# EAGLE design servo_v3_my_v4 (EAGLE 7.6.0)
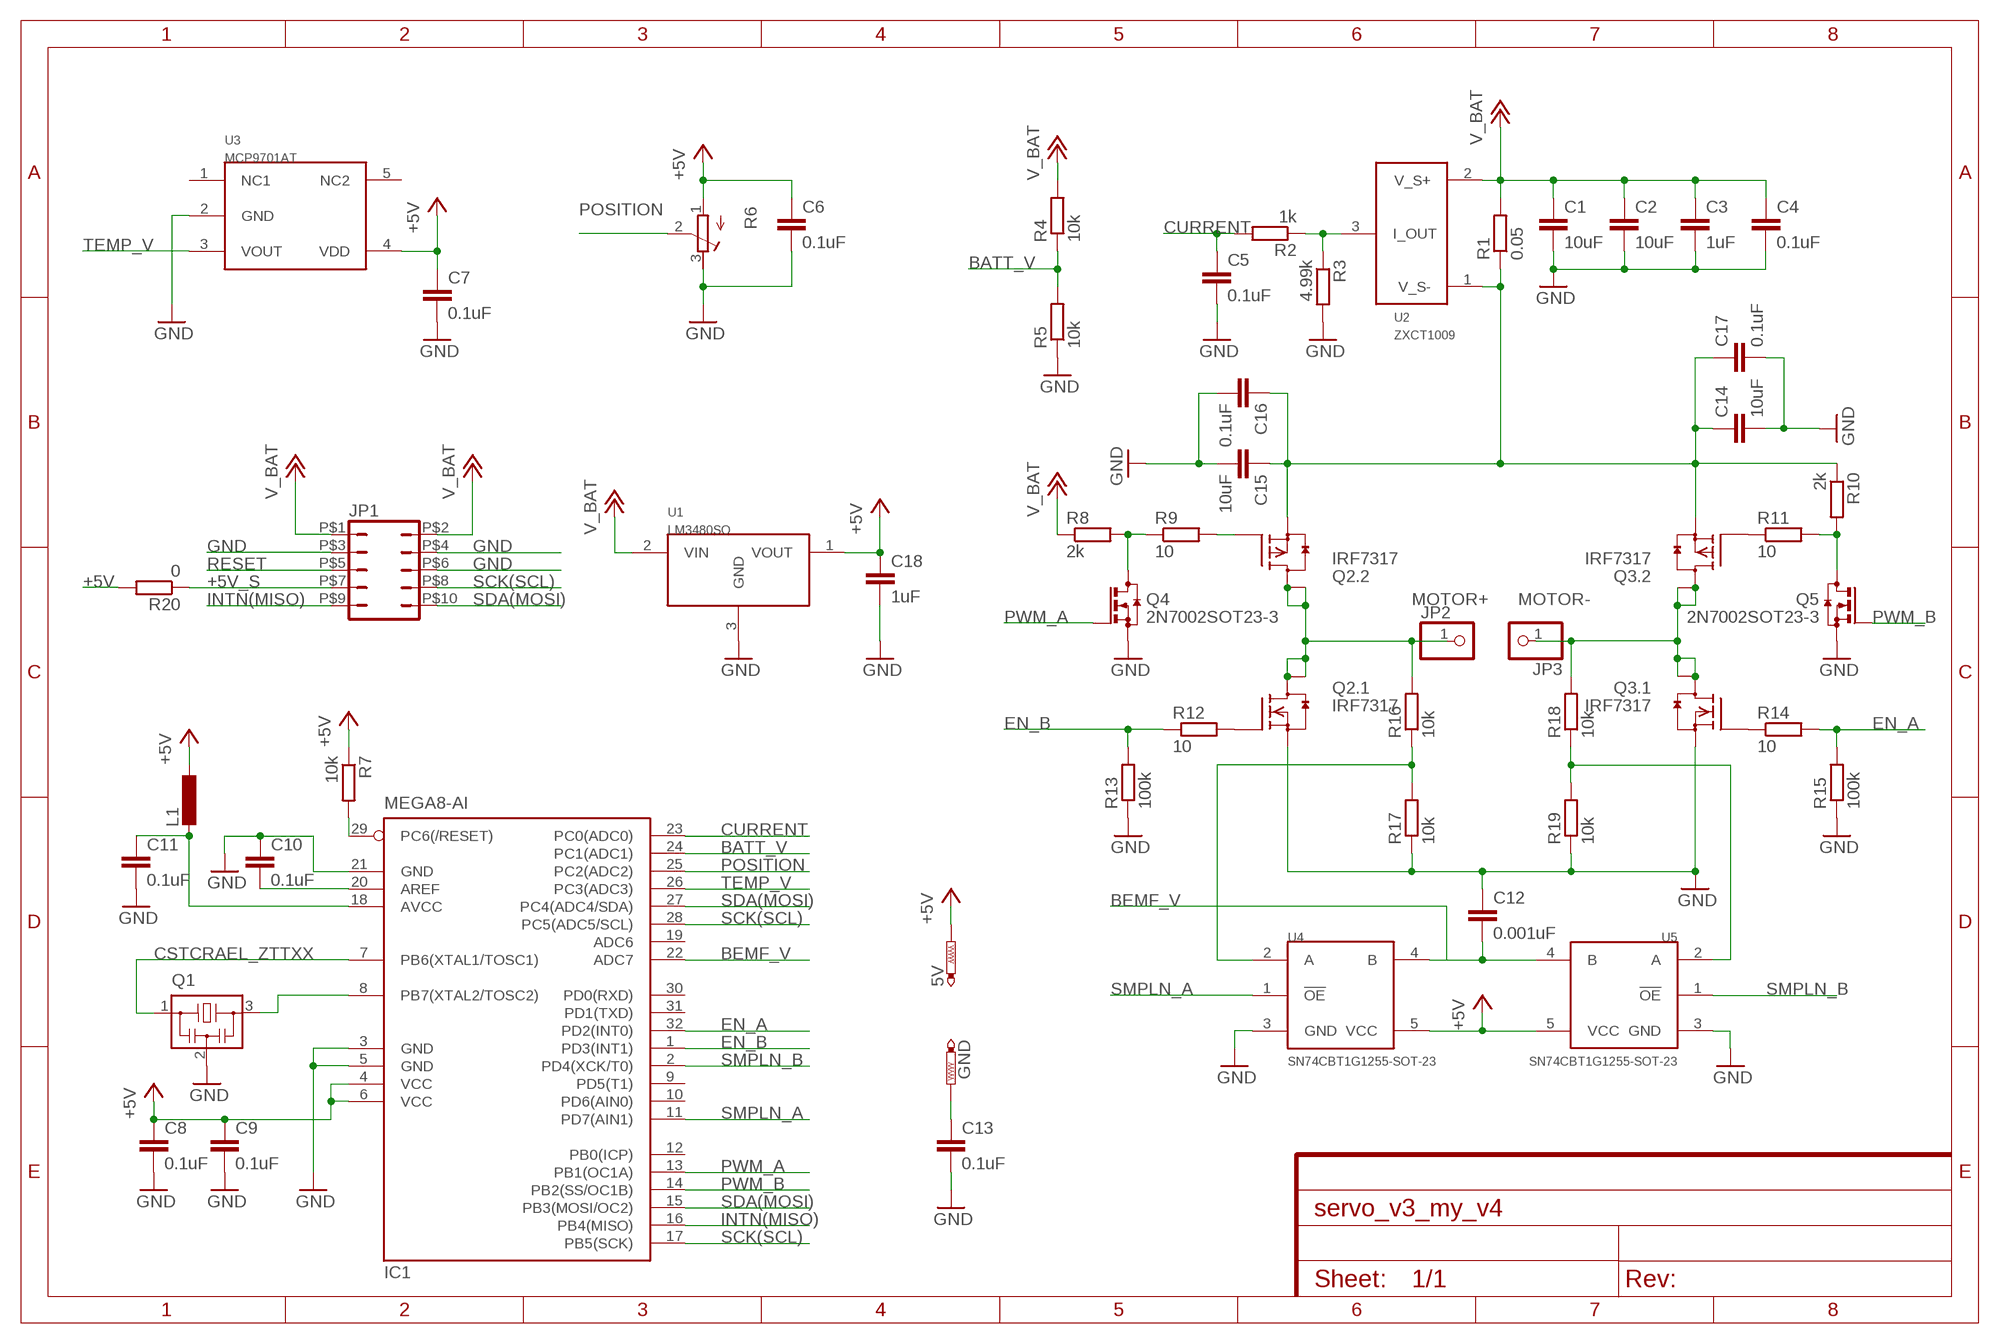
[diagram p0: schematic, sheet 1]

## Parts
5V  PTR1B1,27  [B1,27]
C1  10uF  C-EUC1206  [C1206]
C2  10uF  C-EUC1206  [C1206]
C3  1uF  C-EUC0603  [C0603]
C4  0.1uF  C-EUC0603  [C0603]
C5  0.1uF  C-EUC0603  [C0603]
C6  0.1uF  C-EUC0603  [C0603]
C7  0.1uF  C-EUC0603  [C0603]
C8  0.1uF  C-EUC0603  [C0603]
C9  0.1uF  C-EUC0603  [C0603]
C10  0.1uF  C-EUC0603  [C0603]
C11  0.1uF  C-EUC0603  [C0603]
C12  0.001uF  C-EUC0603  [C0603]
C13  0.1uF  C-EUC0603  [C0603]
C14  10uF  C-EUC1206  [C1206]
C15  10uF  C-EUC1206  [C1206]
C16  0.1uF  C-EUC0603  [C0603]
C17  0.1uF  C-EUC0603  [C0603]
C18  1uF  C-EUC0603  [C0603]
GND  PTR1B1,27  [B1,27]
IC1  MEGA8-AI  [TQFP32-08]
JP1  JP5QJP5Q_SMD  [JP5_DUAL_SIDE]
JP2  PINHD-1X1  [1X01]
JP3  PINHD-1X1  [1X01]
L1  L-EUL0603  [C0603]
Q1  CSTCRAEL_ZTTXX  [CSTCE_WIDE]
Q2  IRF7317  [SO-8]
Q3  IRF7317  [SO-8]
Q4  2N7002SOT23-3  [SOT23]
Q5  2N7002SOT23-3  [SOT23]
R1  0.05  R-EU_R1206  [R1206]
R2  1k  R-EU_R0603  [R0603]
R3  4.99k  R-EU_R0603  [R0603]
R4  10k  R-EU_R0603  [R0603]
R5  10k  R-EU_R0603  [R0603]
R6  R-TRIMM  [RTRIM_SMALL]
R7  10k  R-EU_R0603  [R0603]
R8  2k  R-EU_R0603  [R0603]
R9  10  R-EU_R0603  [R0603]
R10  2k  R-EU_R0603  [R0603]
R11  10  R-EU_R0603  [R0603]
R12  10  R-EU_R0603  [R0603]
R13  100k  R-EU_R0603  [R0603]
R14  10  R-EU_R0603  [R0603]
R15  100k  R-EU_R0603  [R0603]
R16  10k  R-EU_R0603  [R0603]
R17  10k  R-EU_R0603  [R0603]
R18  10k  R-EU_R0603  [R0603]
R19  10k  R-EU_R0603  [R0603]
R20  0  R-EU_R0603  [R0603]
U1  LM3480SO  [SOT23]
U2  ZXCT1009  [SOT23]
U3  MCP9701AT  [SC-70-5]
U4  SN74CBT1G1255-SOT-23  [SOT23-5]
U5  SN74CBT1G1255-SOT-23  [SOT23-5]

## Nets
+5V: 5V.TP C6.1 C7.1 C8.1 C9.1 C18.1 IC1.4(VCC) IC1.6(VCC) L1.1 R6.1(A) R7.1 R20.2 U1.1(VOUT) U3.4(VDD) U4.5(VCC) U5.5(VCC)
+5V_S: JP1.P$7 R20.1
BATT_V: IC1.24(PC1(ADC1)) R4.1 R5.2
BEMF_V: C12.2 IC1.22(ADC7) U4.4(B) U5.4(B)
CURRENT: C5.1 IC1.23(PC0(ADC0)) R2.2
EN_A: IC1.32(PD2(INT0)) R14.2 R15.2
EN_B: IC1.1(PD3(INT1)) R12.1 R13.2
GND: C1.2 C2.2 C3.2 C4.2 C5.2 C6.2 C7.2 C8.2 C9.2 C10.1 C11.2 C12.1 C13.2 C14.2 C15.2 C16.2 C17.2 C18.2 IC1.3(GND) IC1.5(GND) IC1.21(GND) JP1.P$3 JP1.P$4 JP1.P$6 Q1.2 Q2.1(.1:S) Q3.1(.1:S) Q4.2(S) Q5.2(S) R3.2 R5.1 R6.3(E) R13.1 R15.1 R17.1 R19.1 U1.3(GND) U3.2(GND) U4.3(GND) U5.3(GND)
INTN(MISO): IC1.16(PB4(MISO)) JP1.P$9
MOTOR+: JP2.1 Q2.5(.2:D) Q2.6(.2:D) Q2.7(.1:D) Q2.8(.1:D) R16.2
MOTOR-: JP3.1 Q3.5(.2:D) Q3.6(.2:D) Q3.7(.1:D) Q3.8(.1:D) R18.2
N$1: R2.1 R3.1 U2.3(I_OUT)
N$2: IC1.7(PB6(XTAL1/TOSC1)) Q1.1
N$3: IC1.8(PB7(XTAL2/TOSC2)) Q1.3
N$4: C11.1 IC1.18(AVCC) L1.2
N$5: C10.2 IC1.20(AREF)
N$6: C14.1 C15.1 C16.1 C17.1 Q2.3(.2:S) Q3.3(.2:S) R1.1 R10.1 U2.1(V_S-)
N$7: Q4.3(D) R8.2 R9.1
N$8: Q2.4(.2:G) R9.2
N$9: Q5.3(D) R10.2 R11.2
N$10: C13.1 GND.TP
N$14: Q2.2(.1:G) R12.2
N$15: Q3.2(.1:G) R14.1
N$18: Q3.4(.2:G) R11.1
N$20: R18.1 R19.2 U5.2(A)
N$21: R16.1 R17.2 U4.2(A)
POSITION: IC1.25(PC2(ADC2)) R6.2(S)
PWM_A: IC1.13(PB1(OC1A)) Q4.1(G)
PWM_B: IC1.14(PB2(SS/OC1B)) Q5.1(G)
RESET: IC1.29(PC6(/RESET)) JP1.P$5 R7.2
SCK(SCL): IC1.17(PB5(SCK)) IC1.28(PC5(ADC5/SCL)) JP1.P$8
SDA(MOSI): IC1.15(PB3(MOSI/OC2)) IC1.27(PC4(ADC4/SDA)) JP1.P$10
SMPLN_A: IC1.11(PD7(AIN1)) U4.1(!OE)
SMPLN_B: IC1.2(PD4(XCK/T0)) U5.1(!OE)
TEMP_V: IC1.26(PC3(ADC3)) U3.3(VOUT)
V_BAT: C1.1 C2.1 C3.1 C4.1 JP1.P$1 JP1.P$2 R1.2 R4.2 R8.1 U1.2(VIN) U2.2(V_S+)
Unconnected: IC1.9(PD5(T1)) IC1.10(PD6(AIN0)) IC1.12(PB0(ICP)) IC1.19(ADC6) IC1.30(PD0(RXD)) IC1.31(PD1(TXD)) U3.1(NC1) U3.5(NC2)

## Library data of the parts
5V GND = testpad:PTR1: TEST PIN; OC_NEWARK: unknown
C1-C11 C13-C18 = rcl:C-EU: CAPACITOR, European symbol; OC_NEWARK: unknown
C12 = rcl:C-EU: CAPACITOR, European symbol; MPN: BFC237052102; OC_NEWARK: 74K3422
IC1 = atmel:MEGA8: MICROCONTROLLER 8 Kbytes FLASH, 1 kbytes SRAM, 512 bytes EEPROM, USART, 6-channel 10 bit ADC, 2-channel 8 bit ADC Pin compatible with Atmega48, ATMega88, ATMega168 Source: avr.lbr; MPN: ATMEGA8-16AU; OC_FARNELL: 9171371; OC_NEWARK: unknown
JP1 = jumper:JP5Q: JUMPER; OC_NEWARK: unknown
JP2 JP3 = pinhead:PINHD-1X1: PIN HEADER; OC_NEWARK: unknown
L1 = rcl:L-EU: INDUCTOR, European symbol; OC_NEWARK: unknown
Q1 = murata-filter:CSTCR: Resonator Source: murata.co.jp; OC_NEWARK: unknown
Q2 Q3 = m-pad-2.1:IRF7317: International Rectifier's IRF7317 HEXFET® Power MOSFET Description: Fifth Generation HEXFETs from International Rectifier utilize advanced processing techniques to achieve extremely low on-resistance per silicon area. This benefit, combined with the fast switching speed and ruggedized device design that HEXFET Power MOSFETs are well known for, provides the designer with an extremely efficient and reliable device for use in a wide variety of applications. The SO-8 has been modified through a customized leadframe for enhanced thermal characteristics and multiple-die capability making it ideal in a variety of power applications. With these improvements, multiple devices can be used in an application with dramatically reduced board space. The package is designed for vapor phase, infra red, or wave soldering techniques. Features: Generation V Technology Ultra Low On-Resistance Dual N and P Channel MOSFET Surface Mount Fully Avalanche Rated Please send any comments to: messi@users.sourceforge.net; OC_NEWARK: unknown
Q4 Q5 = transistor-small-signal:2N7002: N-channel enhancement mode Field-Effect Transistor (FET) in a plastic package using TrenchMOS technology. SOT23; OC_NEWARK: unknown
R1-R5 R7-R20 = rcl:R-EU_: RESISTOR, European symbol; OC_NEWARK: unknown
R6 = rcl:R-TRIMM: Trimm resistor; OC_NEWARK: unknown
U1 = texas:LM3480: LM3480 100-mA, SOT-23, Quasi Low-Dropout Linear Voltage Regulator; Input Voltage Range: up to 30 V, 3.3-V, 5-V, 12-V, and 15-V Versions Available; link: http://www.farnell.com/datasheets/1997652.pdf; OC_NEWARK: unknown
U2 = diode:ZXCT1009: The ZXCT1009 is a high side current sense monitor. Using this device eliminates the need to disrupt the ground plane when sensing a load current.; OC_NEWARK: unknown
U3 = microchip:MCP9701AT: Tiny Analog Temperature Sensor; OC_NEWARK: unknown
U4 U5 = m-pad-2.1:SN74CBT1G125: 5-Ω Switch Connection Between Two Ports TTL-Compatible Control Input Levels Latch-Up Performance Exceeds 250 mA Per JESD 17 ESD Protection Exceeds JESD 22 – 2000-V Human-Body Model (A114-A) – 200-V Machine Model (A115-A) http://www.farnell.com/datasheets/1862443.pdf; OC_NEWARK: unknown

## Board
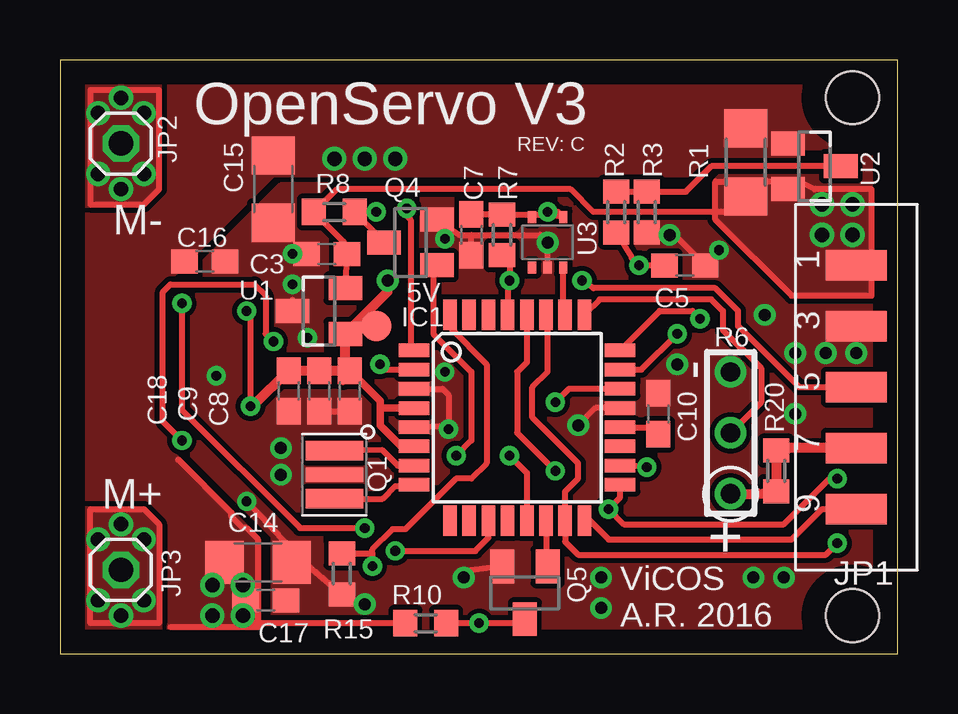
[diagram p1: board, top side]
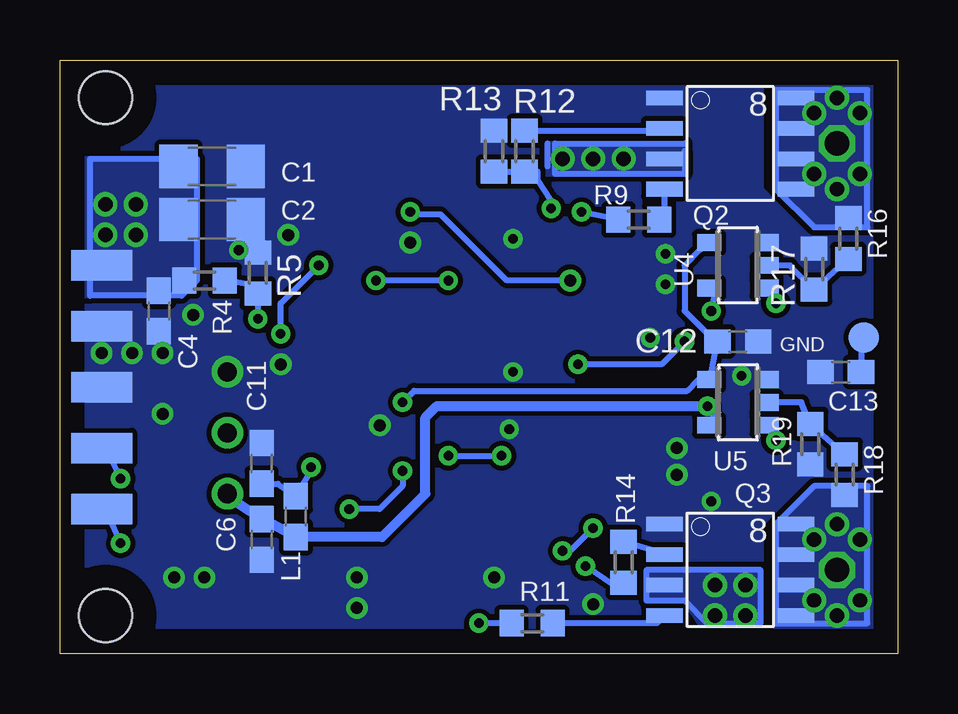
[diagram p2: board, bottom side, seen from below]

Size 34.91 x 24.75 mm. Coordinates in mm from the lower left corner, seen from the top.
Outline: 0,0 34.91,0 34.91,24.75 0,24.75 0,0
Copper layers (1*16): Top 0.035mm / dielectric 1.5mm / Bottom 0.035mm
Design rules "default": minimum track width 10mil, minimum drill 24mil, track to track 8mil, track to pad 8mil, pad to pad 8mil, via to via 8mil, smd to smd 8mil, copper to edge 40mil, drill to drill 8mil, minimum pad ring 10mil, minimum via ring 8mil, stop-mask expansion 4mil, vias tented up to drill 0mil, thermal gap 10mil
Holes 2.2 mm at 33.02,1.59 33.02,23.18

### Footprints (pad centres in the part's own frame; a part is rotated, then mirrored left to right if it is on the bottom)
B1,27 = smd 1.27 x 1.27: TP 0,0
C1206 = smd 1.6 x 1.8: 1 -1.4,0; 2 1.4,0
C0603 = smd 1.1 x 1: 1 -0.85,0; 2 0.85,0
TQFP32-08 = smd 1.27 x 0.559: 1 -4.293,2.8; 2 -4.293,2; 3 -4.293,1.2; 4 -4.293,0.4; 5 -4.293,-0.4; 6 -4.293,-1.2; 7 -4.293,-2; 8 -4.293,-2.8; 17 4.293,-2.8; 18 4.293,-2; 19 4.293,-1.2; 20 4.293,-0.4; 21 4.293,0.4; 22 4.293,1.2; 23 4.293,2; 24 4.293,2.8 | smd 0.559 x 1.27: 9 -2.8,-4.293; 10 -2,-4.293; 11 -1.2,-4.293; 12 -0.4,-4.293; 13 0.4,-4.293; 14 1.2,-4.293; 15 2,-4.293; 16 2.8,-4.293; 25 2.8,4.293; 26 2,4.293; 27 1.2,4.293; 28 0.4,4.293; 29 -0.4,4.293; 30 -1.2,4.293; 31 -2,4.293; 32 -2.8,4.293
JP5_DUAL_SIDE = smd 1.27 x 2.54: P$1 -5.08,0; P$3 -2.54,0; P$5 0,0; P$7 2.54,0; P$9 5.08,0 | smd 1.27 x 2.54 bottom: P$2 -5.08,0; P$4 -2.54,0; P$6 0,0; P$8 2.54,0; P$10 5.08,0
1X01 = drill 1.016 octagon: 1 0,0
CSTCE_WIDE = smd 0.8 x 2.4: 1 -1,0; 3 1,0 | smd 0.6 x 2.4: 2 0,0
SO-8 = smd 1.524 x 0.61: 1 -2.743,1.27; 2 -2.743,0; 3 -2.743,-1.27; 4 -2.743,-2.54; 5 2.743,-2.54; 6 2.743,-1.27; 7 2.743,0; 8 2.743,1.27
SOT23 = smd 1 x 1.4: 1 -0.95,-1.1; 2 0.95,-1.1; 3 0,1.1
R1206 = smd 1.6 x 1.803: 1 -1.422,0; 2 1.422,0
R0603 = smd 1 x 1.1: 1 -0.85,0; 2 0.85,0
RTRIM_SMALL = drill 0.8: 1 0,-2.54; 2 0,0; 3 0,2.54
SC-70-5 = smd 0.35 x 0.5: 1 -0.65,-1.05; 2 0,-1.05; 3 0.65,-1.05; 4 0.65,1.05; 5 -0.65,1.05
SOT23-5 = smd 0.7 x 1: 1 -0.95,-1.2; 2 0,-1.2; 3 0.95,-1.2; 4 0.95,1.2; 5 -0.95,1.2

### Placement (x,y rotation side)
5V  13.18,13.65 0 top
C1  28.57,20.32 0 bottom
C2  28.57,18.1 0 bottom
C3  11.11,16.67 180 top
C4  30.8,14.29 270 bottom
C5  26.04,16.19 0 top
C6  26.51,4.76 270 bottom
C7  17.14,17.46 270 top
C8  12.06,10.95 270 top
C9  10.79,10.95 270 top
C10  24.92,10 270 top
C11  26.51,7.94 90 bottom
C12  6.67,13.02 180 bottom
C13  2.38,11.75 180 bottom
C14  8.26,3.81 0 top
C15  8.89,19.37 270 top
C16  6.03,16.35 0 top
C17  8.57,2.22 0 top
C18  9.53,10.95 270 top
GND  1.43,13.18 0 bottom
IC1  19.05,9.84 0 top
JP1  33.18,11.11 270 top
JP2  2.54,21.27 0 top
JP3  2.54,3.49 0 top
L1  25.08,5.71 90 bottom
Q1  11.43,7.46 270 top
Q2  6.99,21.91 0 bottom
Q3  6.99,4.13 0 bottom
Q4  14.61,17.14 90 top
Q5  19.37,2.54 180 top
R1  28.57,20.48 270 top
R2  23.18,18.41 270 top
R3  24.45,18.41 270 top
R4  28.89,15.56 180 bottom
R5  26.67,15.88 270 bottom
R6  27.94,9.21 0 top
R7  18.41,17.46 270 top
R8  11.43,18.41 0 top
R9  10.79,18.1 0 bottom
R10  15.24,1.27 0 top
R11  15.24,1.27 180 bottom
R12  15.56,20.95 90 bottom
R13  16.83,20.95 270 bottom
R14  11.43,3.81 270 bottom
R15  11.75,3.33 90 top
R16  2.06,17.3 90 bottom
R17  3.49,16.03 270 bottom
R18  2.22,7.46 270 bottom
R19  3.65,8.73 90 bottom
R20  29.84,7.62 270 top
U1  10.79,14.29 90 top
U2  31.43,20.32 270 top
U3  20.32,17.14 0 top
U4  6.67,16.19 90 bottom
U5  6.67,10.48 90 bottom

### Tracks (layer width: path | path; a pad name or v marks a point on that pad's centre or on a via)
+5V  (via drill 0.4, 0.5)
  Top 0.254: C7.1 R7.1 20.54,18.31 U3.4 20.75,18.41 v20.32,18.41 | IC1.6 14.22,8.64 | 11.79,11.33 C8.1 11.89,11.97 | 8.04,10.32 v7.94,10.32 7.94,14.13 v7.78,14.29 | U1.1 12.3,13.74 12.38,13.65 5V.TP
  Top 0.305: IC1.4 13.34,10.24 | 14.22,8.64 13.34,9.53 13.34,10.24 | C8.1 13.34,10.53 13.34,10.24
  Top 0.406: C8.1 C9.1 C18.1 8.04,10.32 | 11.89,11.97 U1.1 | 12.3,13.74 13.65,15.1 v13.65,15.56 | R6.1 29.11,6.67 R20.2
  Bottom 0.254: U5.5 7.61,9.83 v7.94,10.32 | v13.65,15.56 16.3,15.56 19.05,18.31 20.22,18.31 v20.32,18.41 | U4.5 7.62,15.16 v7.78,14.29 | 27.94,6.57 R6.1
  Bottom 0.406: 7.78,10.32 v7.94,10.32 19.21,10.32 19.68,9.84 19.68,6.67 21.49,4.87 L1.1 26.56,5.66 C6.1 27.94,6.57
+5V_S
  Top 0.254: 30.38,8.57 R20.1
  Top 0.406: JP1.P$7 30.38,8.57
BATT_V  (via drill 0.4)
  Top 0.254: IC1.24 24.99,14.29 26.35,14.29 v26.67,13.97
  Bottom 0.254: R4.1 26.72,15.34 R5.2 v26.67,13.97
BEMF_V  (via drill 0.4)
  Top 0.254: IC1.22 21.2,11.04 v20.64,10.48
  Bottom 0.254: U4.4 8.24,16.84 8.89,16.19 8.89,14.29 7.62,13.02 C12.2 7.83,11.33 U5.4 8.31,11.43 8.79,10.95 20.16,10.95 v20.64,10.48
CURRENT  (via drill 0.4)
  Top 0.254: R2.2 23.81,16.51 v24.13,16.19 C5.1 | IC1.23 24.23,11.84 v25.72,13.34
  Bottom 0.254: v25.72,13.34 25.72,14.61 v24.13,16.19
EN_A  (via drill 0.4)
  Top 0.254: IC1.32 16.25,13.6 17.78,12.06 17.78,7.94 17.14,7.3 16.51,7.3 14.39,5.18 13.86,5.18 13.02,4.34 13.02,4.18 | R15.2 13.02,4.18 | 13.02,4.18 v13.02,3.65
  Bottom 0.254: R14.2 11.85,2.86 v13.02,3.65
EN_B  (via drill 0.4)
  Top 0.254: v14.45,18.57 14.13,18.57 14.61,18.1 14.61,12.79 IC1.1
  Bottom 0.254: v14.45,18.57 14.45,18.89 15.03,19.79 15.03,20.11 R12.1 R13.2
GND  (via drill 0.4, 0.5)
  Top 0.254: C9.2 C8.2 | IC1.5 16.11,9.53 v16.19,9.37 16.19,10.79 15.95,11.04 IC1.3 | U3.2 v20.32,17.14 20,17.46 17.14,17.46 | C7.2 17.14,17.46 | Q4.2 16.66,17.46 17.14,17.46 | IC1.21 22.31,10.24 v21.59,9.53 | 9.7,14.75 U1.3 | R3.2 24.55,17.46 v25.4,17.46 25.61,17.46 C5.2 | Q5.2 17.13,3.48 v16.83,3.17 | R15.1 10.16,3.81 v7.78,6.35
  other vias: 9.21,7.46 9.68,15.4 6.51,11.59 28.89,3.17 9.21,8.57 25.72,12.06 30.16,3.17 22.54,1.91 12.7,2.06 10.32,13.18 9.68,16.67 16.03,17.3 29.37,14.13 33.18,12.54 31.91,12.54 30.64,12.54 30.64,10 16.03,11.75 27.46,16.83 22.54,3.17
  pour Bottom (no thermals): 5.71,25.72 5.71,19.37 3.81,17.46 -1.91,17.46 -1.91,7.3 3.81,7.3 5.71,5.4 5.71,-1.59 36.2,-1.59 36.2,25.72
  pour Top (no thermals): 36.2,14.45 30.32,14.45 28.1,16.67 28.1,19.53 9.21,19.53 4.76,15.08 3.81,15.08 3.81,10 8.89,4.92 8.89,-0.48 36.2,-0.48
INTN(MISO)
  Top 0.254: IC1.16 22.07,5.55 22.86,4.76 30.48,4.76 31.75,6.03 JP1.P$9
MOTOR+  (via drill 0.6)
  Top 0.254: 1.27,18.73 3.49,18.73 4.13,19.37 4.13,23.5 1.27,23.5 1.27,18.73
  Bottom 0.254: 5.08,23.5 5.08,19.37 3.49,17.78 1.27,17.78 1.27,23.5 5.08,23.5
  other vias: 1.59,22.54 2.54,23.18 1.59,20 3.49,22.54 3.49,20 2.54,19.37
  pour Bottom (no thermals): -0.64,17.78 3.49,17.78 5.08,19.37 5.08,25.72 -0.64,25.72
  pour Top (no thermals): -0.64,18.73 3.49,18.73 4.13,19.37 4.13,25.08 -0.64,25.08
MOTOR-  (via drill 0.6)
  Top 0.254: 1.27,6.03 3.49,6.03 4.13,5.4 4.13,1.27 1.27,1.27 1.27,6.03
  Bottom 0.254: 1.27,6.99 3.49,6.99 5.08,5.4 5.08,1.27 1.27,1.27 1.27,6.99
  other vias: 1.59,2.22 3.49,4.76 1.59,4.76 2.54,5.4 2.54,1.59 3.49,2.22
  pour Bottom (no thermals): -1.91,6.99 3.49,6.99 5.08,5.4 5.08,-1.59 -1.91,-1.59
  pour Top (no thermals): -0.64,6.03 3.49,6.03 4.13,5.4 4.13,-0.64 -0.64,-0.64
N$1
  Top 0.254: R2.1 R3.1 26.08,19.27 27.14,20.32 U2.3
N$2
  Top 0.254: IC1.7 14.06,7.84 13.42,8.48 Q1.1
N$3
  Top 0.254: Q1.3 13.45,6.46 13.97,6.99 14.7,6.99 IC1.8
N$4  (via drill 0.4)
  Top 0.254: IC1.18 23.91,7.84 v24.45,7.78
  Bottom 0.254: C11.1 25.83,7.09 L1.2 24.45,7.62 v24.45,7.78
N$5
  Top 0.254: IC1.20 24.63,9.44 C10.2
N$6  (via drill 0.6)
  Top 0.254: R10.1 7.94,1.27 v7.62,1.59 | 4.6,1.11 8.26,1.11 8.26,4.76 7.78,5.24 7.62,5.24 7.14,5.71 7.14,5.87 4.92,8.1
  Bottom 0.254: 8.89,21.27 14.29,21.27 14.29,20 8.89,20 8.89,20.95 | 14.61,21.27 14.61,20.32 | 5.71,3.49 10.48,3.49 10.48,2.22 8.89,2.22 7.94,1.27 5.71,1.27 5.71,3.49
  other vias: 11.43,20.64 12.7,20.64 13.97,20.64 7.62,2.86 6.35,2.86 6.35,1.59
  pour Top (no thermals): 4.45,26.35 4.45,20 29.84,20 30.96,21.11 36.04,21.11 36.2,26.35
  pour Bottom (no thermals): 8.89,21.27 8.89,20 14.61,20 14.61,21.27
  pour Bottom (no thermals): 5.71,3.49 10.48,3.49 10.48,2.22 8.89,2.22 8.26,1.27 5.71,1.27
  pour Top (no thermals): -1.91,20.64 8.89,20.64 8.89,20 4.45,15.56 4.45,8.57 8.26,4.76 8.26,-1.59 -1.91,-1.59
N$7  (via drill 0.4)
  Top 0.254: Q4.3 R8.2 v13.18,18.41
  Bottom 0.254: R9.1 v13.18,18.41
N$8
  Bottom 0.254: Q2.4 9.73,18.31 R9.2
N$9  (via drill 0.4)
  Top 0.254: Q5.3 18.9,1.27 v17.46,1.27 R11.2
  Bottom 0.254: R11.2 v17.46,1.27
N$10
  Bottom 0.254: GND.TP 1.53,13.07 C13.1
N$11
  Top 0.406: 29.84,8.26 29.84,6.99
N$14
  Bottom 0.254: R12.2 9.73,21.8 Q2.2
N$15
  Bottom 0.254: Q3.2 9.2,4.03 R14.1
N$18
  Bottom 0.254: Q3.4 10.05,1.27 R11.1
N$20
  Bottom 0.254: R18.1 R19.2 4.03,10.48 U5.2
N$21
  Bottom 0.254: R16.1 R17.2 4.5,16.19 U4.2
POSITION
  Top 0.254: IC1.25 22.48,14.77 27.14,14.77 27.62,14.29 27.62,13.49 29.21,11.91 29.21,10.48 R6.2
PWM_A  (via drill 0.4)
  Top 0.254: Q4.1 15.56,16.05 15.56,13.34 17.14,11.75 17.14,8.89 v16.51,8.26 | v18.73,8.26 19.45,7.54 IC1.13
  Bottom 0.254: v18.73,8.26 v16.51,8.26
PWM_B
  Top 0.254: IC1.14 20.25,4.06 20.15,3.32 Q5.1
RESET  (via drill 0.4)
  Top 0.254: v21.75,15.56 22.23,15.24 27.3,15.24 28.26,14.29 28.26,13.65 30.8,11.11 JP1.P$5 | IC1.29 18.65,15.32 v18.73,15.56 18.73,16.3 R7.2
  Bottom 0.254: v18.73,15.56 v21.75,15.56
SCK(SCL)  (via drill 0.4)
  Top 0.254: v32.38,7.3 32.07,7.3 30.16,5.4 23.5,5.4 v22.86,6.03 23.34,6.51 IC1.17 | IC1.28 19.45,12.15 19.05,11.75 19.05,9.21 v20.64,7.62
  Bottom 0.254: v20.64,7.62 20.64,6.99 21.59,6.03 v22.86,6.03 | JP1.P$8 33.02,8.57 v32.38,7.3
SDA(MOSI)  (via drill 0.4)
  Top 0.254: v32.38,4.6 31.91,4.13 21.59,4.13 21.05,4.67 IC1.15 21.05,6.76 21.59,7.3 21.59,7.94 19.68,9.84 19.68,11.11 20.32,11.75 20.32,14.06 IC1.27
  Bottom 0.254: JP1.P$10 33.02,6.03 v32.38,4.6
SMPLN_A  (via drill 0.4)
  Top 0.254: v5.08,14.61 5.08,10.16 10,5.24 v12.7,5.24 | v13.97,4.29 17.3,4.29 17.85,4.83 IC1.11
  Bottom 0.254: U4.1 4.98,14.82 v5.08,14.61 | v12.7,5.24 13.65,4.29 v13.97,4.29
SMPLN_B  (via drill 0.4)
  Top 0.254: v5.08,8.89 4.29,9.68 4.29,15.08 4.6,15.4 8.1,15.4 8.57,14.92 8.57,13.34 v8.89,13.02 | v13.34,12.06 13.56,11.84 IC1.2
  Bottom 0.254: U5.1 4.98,8.79 v5.08,8.89 | v8.89,13.02 9.84,12.06 v13.34,12.06
TEMP_V
  Top 0.254: IC1.26 20.97,14.21 U3.3
V_BAT  (via drill 0.6)
  Top 0.254: U1.2 11.89,15.62 C3.1 11.8,17.19 R8.1 11.53,19.37 21.27,19.37 22.23,18.41 28.57,18.41 R1.2 | 27.94,19.68 30.8,19.68 31.43,19.37 33.81,19.37 33.81,14.92 30.48,14.92 27.3,18.1 27.3,19.68 27.94,19.68 | R1.2 | 27.94,19.68 R1.2
  Bottom 0.254: 29.21,20.64 29.21,15.56 29.84,14.92 33.66,14.92 33.66,20.64 29.21,20.64
  other vias: 33.02,18.73 31.75,18.73 33.02,17.46 31.75,17.46
  pour Top (no thermals): 27.3,19.68 27.3,18.1 30.48,14.92 36.2,14.92 36.2,20.64 31.43,20.64 30.8,20 27.62,20
  pour Bottom (no thermals): 29.21,20.64 29.21,15.56 29.84,14.92 34.29,14.92 34.29,20.64

### Text on the board
tNames: OpenServo V3 | REV: C | M- | - | M+ | + | ViCOS / A.R. 2016